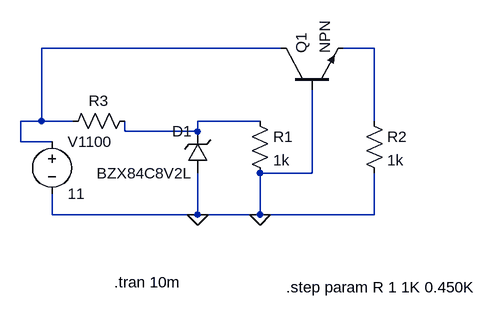
[diagram p0: schematic experiment-1(b).asc]
experiment-1(b).asc, the LTspice schematic file:
Version 4
SHEET 1 880 680
WIRE 528 80 160 80
WIRE 672 80 624 80
WIRE 160 192 160 80
WIRE 160 192 128 192
WIRE 208 192 160 192
WIRE 496 192 400 192
WIRE 672 192 672 80
WIRE 288 208 288 192
WIRE 400 208 400 192
WIRE 400 208 288 208
WIRE 128 224 128 192
WIRE 176 224 128 224
WIRE 576 272 576 144
WIRE 576 272 496 272
WIRE 176 336 176 304
WIRE 400 336 400 272
WIRE 400 336 176 336
WIRE 496 336 496 272
WIRE 496 336 400 336
WIRE 672 336 672 272
WIRE 672 336 496 336
FLAG 400 336 0
FLAG 496 336 0
SYMBOL zener 416 272 R180
WINDOW 0 24 64 Left 2
WINDOW 3 24 0 Left 2
SYMATTR InstName D1
SYMATTR Value BZX84C8V2L
SYMBOL res 480 176 R0
SYMATTR InstName R1
SYMATTR Value 1k
SYMBOL res 656 176 R0
SYMATTR InstName R2
SYMATTR Value 1k
SYMBOL res 304 176 R90
WINDOW 0 0 56 VBottom 2
WINDOW 3 32 56 VTop 2
SYMATTR InstName R3
SYMATTR Value 100
SYMBOL voltage 176 208 R0
SYMATTR InstName V1
SYMATTR Value 11
SYMBOL npn 528 144 R270
SYMATTR InstName Q1
TEXT 536 448 Left 2 !.step param R 1 1K 0.450K
TEXT 272 440 Left 2 !.tran 10m

The netlist it stands for:
* experiment-1(b).asc
D1 0 N003 BZX84C8V2L
R1 N003 0 1k
R2 N002 0 1k
R3 N003 N001 100
V1 N001 0 11
Q1 N001 0 N002 0 NPN
.model D D
.lib standard.dio
.model NPN NPN
.model PNP PNP
.lib standard.bjt
.step param R 1 1K 0.450K
.tran 10m
.backanno
.end